# Altium project Main.PrjPcb
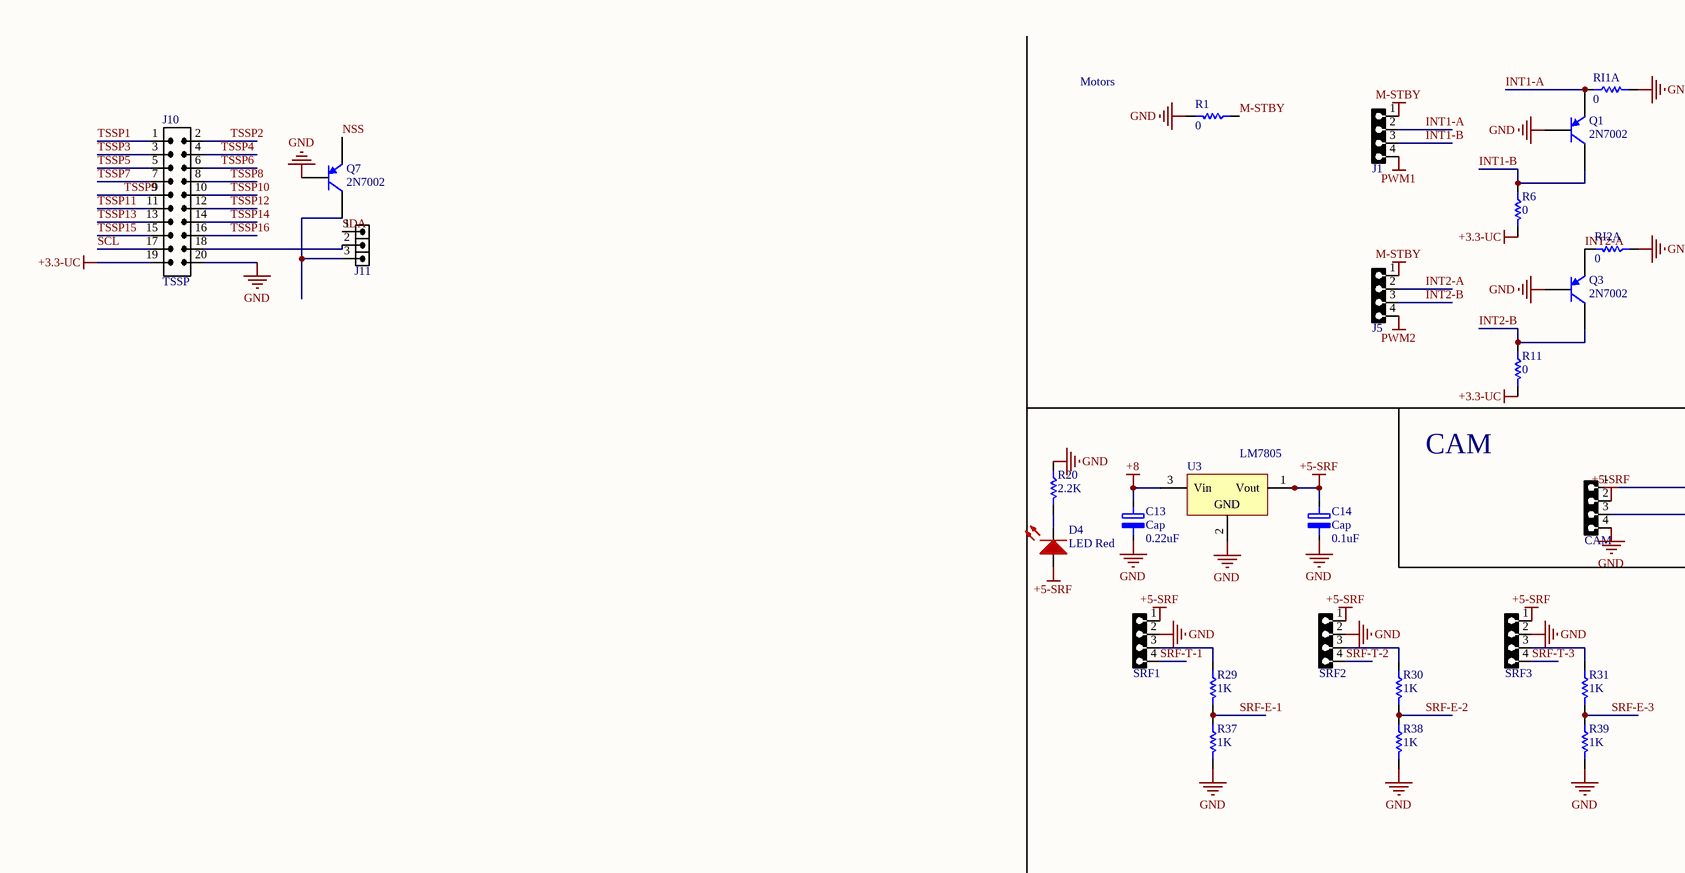
[diagram p0: main.SchDoc, top left]
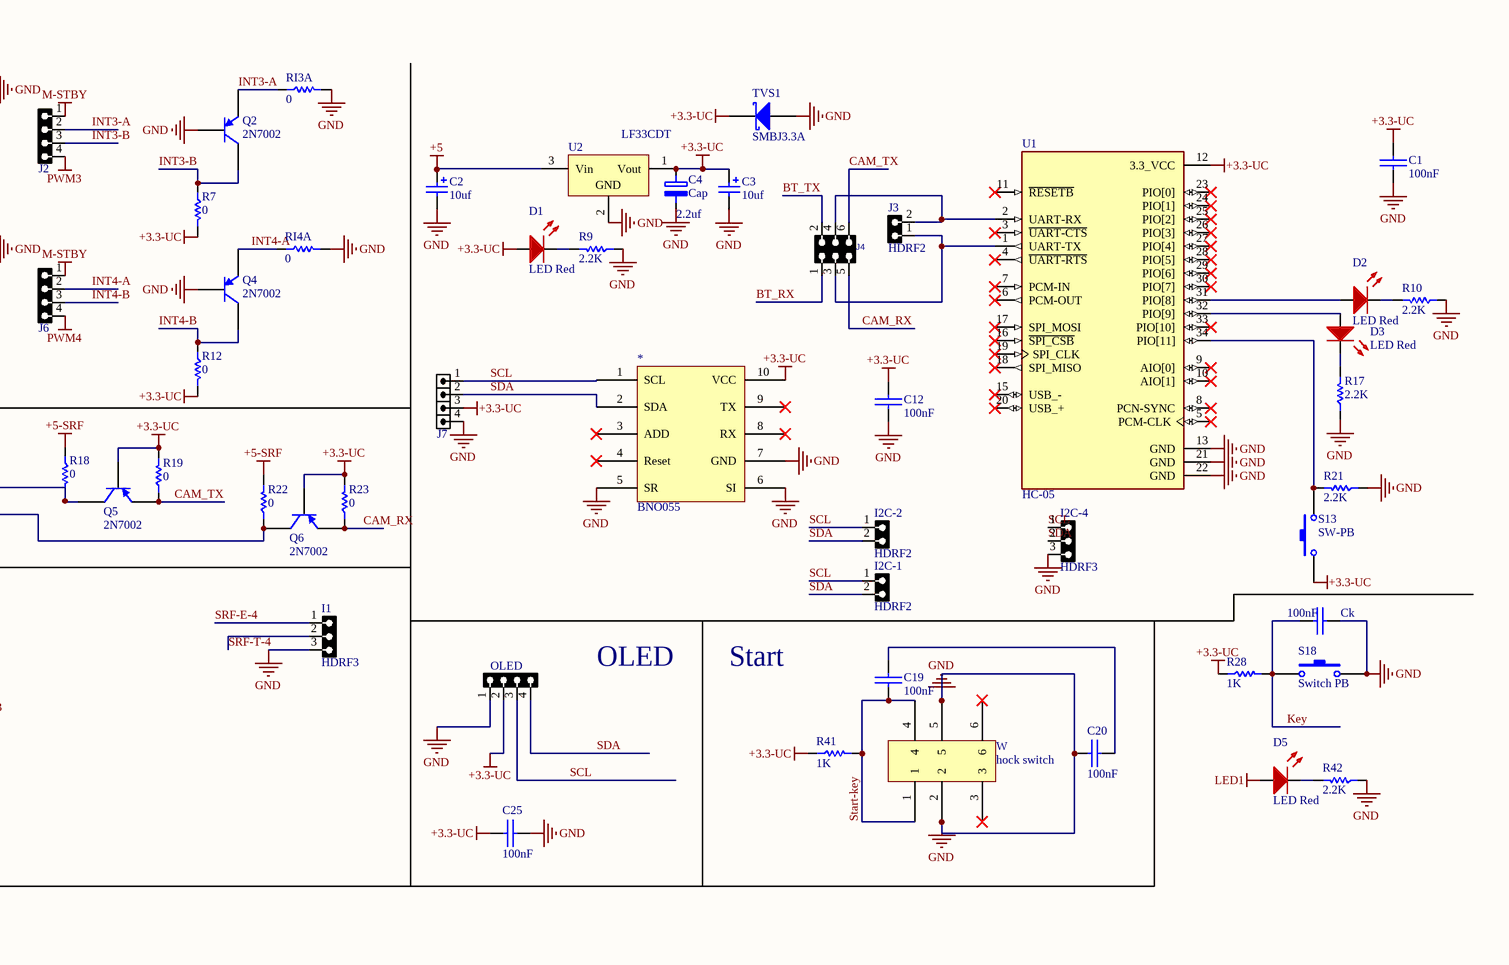
[diagram p1: main.SchDoc, top right]
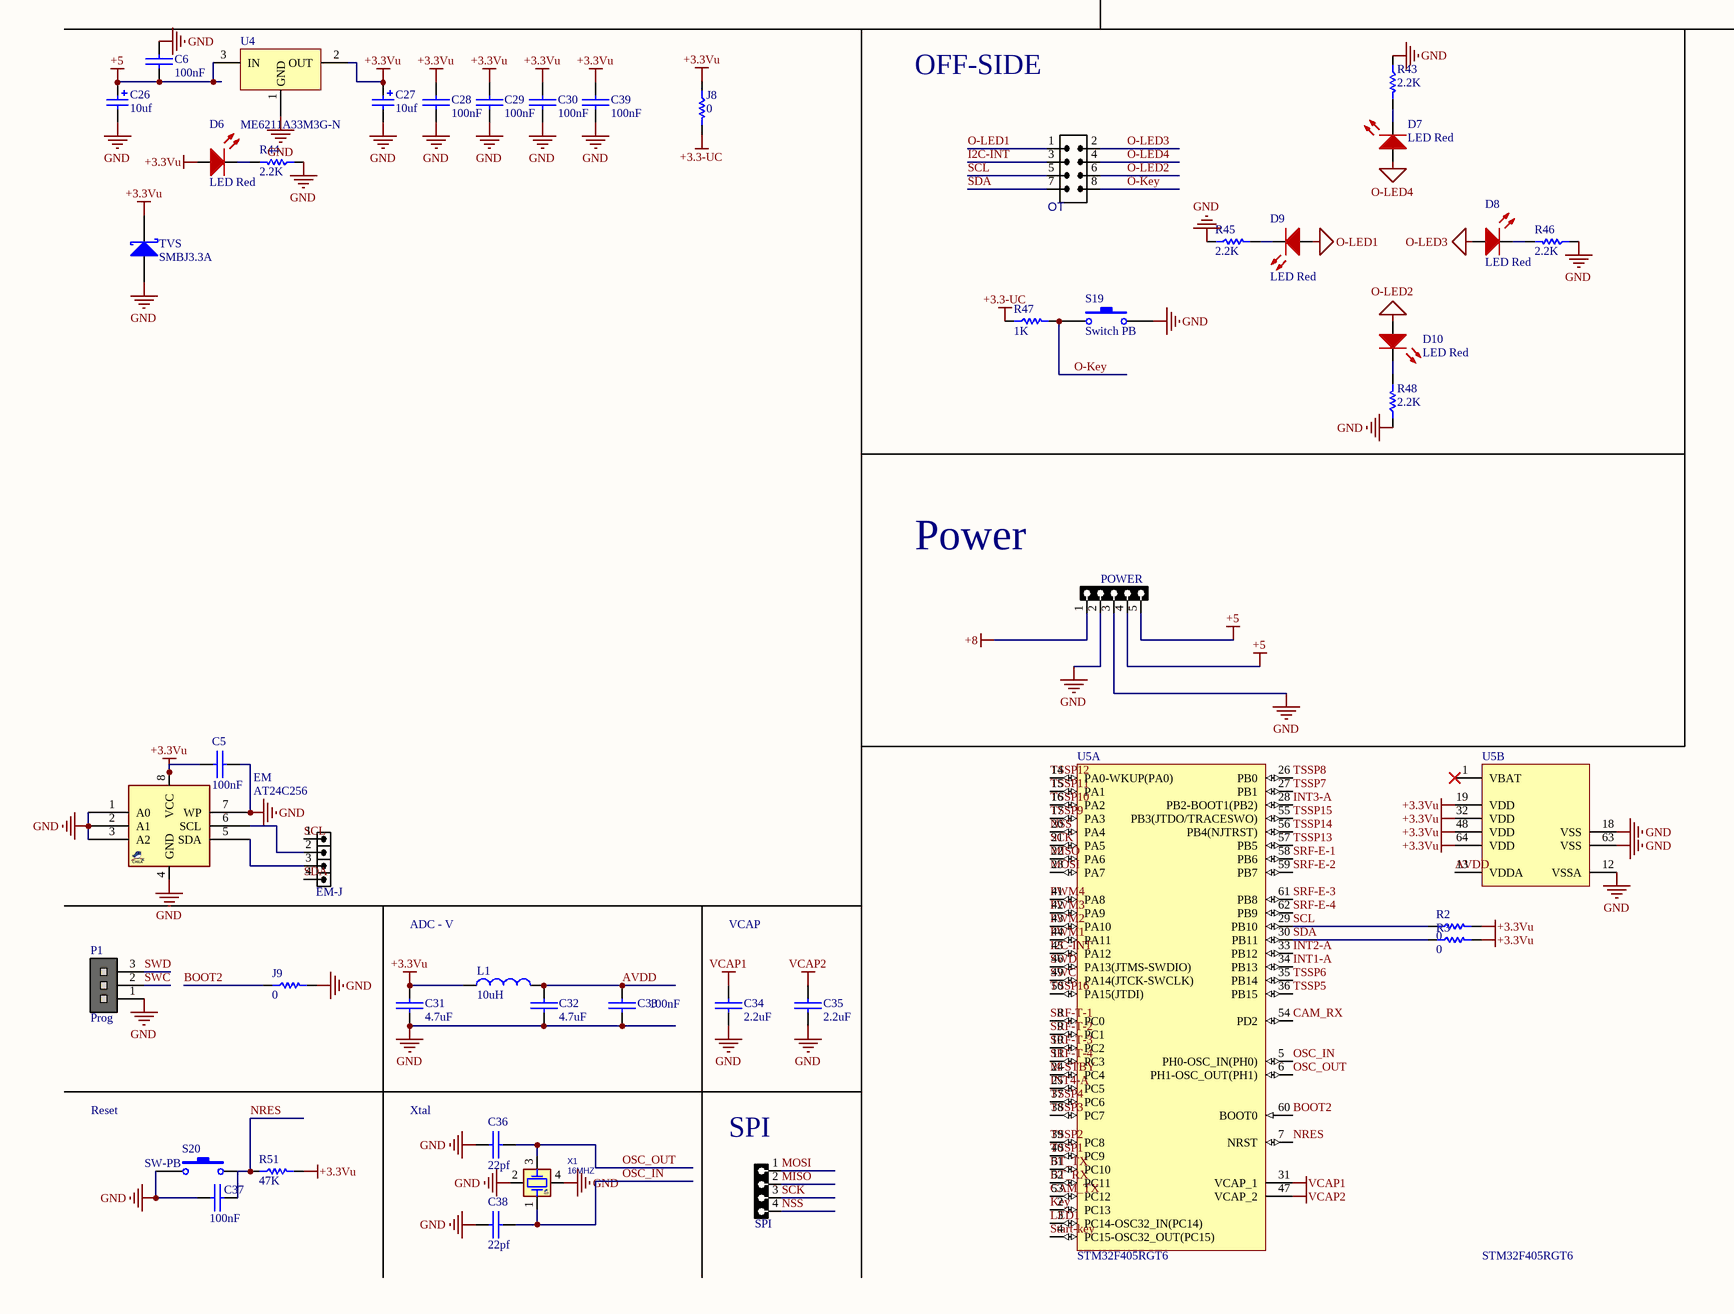
[diagram p2: main.SchDoc, bottom left]
1 sheet, 121 parts. Net scope: global (net labels, ports and power ports of the same name join across sheets).
Board files: main.PcbDoc, Mani-backup.PcbDoc, BNO-convertor.PcbDoc

## Sheet main.SchDoc
size 599 x 400 mm; SheetNumber: 1; SheetTotal: 1

### Parts
*  BNO055  [BNO055]
C1  100nF  [SMD_CAP_0805]
C2  value 10uf  [Cap_A]  (hidden comment: Cap_tan)
C3  value 10uf  [Cap_A]  (hidden comment: Cap_tan)
C4  Cap  value 2.2uf  [Cap_E]
C5  100nF  [C0603]
C6  100nF  [SMD_CAP_0805]
C12  100nF  [SMD_CAP_0805]
C13  Cap  C13: 0.22uF  [Cap1_(2mm)]
C14  Cap  C14: 0.1uF  [Cap1_(2mm)]
C19  100nF  [SMD_CAP_0805]
C20  100nF  [SMD_CAP_0805]
C25  100nF  [SMD_CAP_0805]
C26  value 10uf  [Cap_A]  (hidden comment: Cap_tan)
C27  value 10uf  [Cap_A]  (hidden comment: Cap_tan)
C28  100nF  [C0603]
C29  100nF  [C0603]
C30  100nF  [C0603]
C31  4.7uF  [SMD_CAP_0805]
C32  4.7uF  [SMD_CAP_0805]
C33  100nF  [SMD_CAP_0805]
C34  2.2uF  [C0603]
C35  2.2uF  [C0603]
C36  22pf  [SMD_CAP_0805]
C37  100nF  [SMD_CAP_0805]
C38  22pf  [SMD_CAP_0805]
C39  100nF  [C0603]
CAM  HDRF4  [HDR_F_1X4]  (value not drawn)
Ck  100nF  [SMD_CAP_0805]
D1  LED Red  [LED_Red_1206]
D2  LED Red  [LED_Red_1206]
D3  LED Red  [LED_Red_1206]
D4  LED Red  [LED_Red_1206]
D5  LED Red  [LED_Red_1206]
D6  LED Red  [LED_Red_1206]
D7  LED Red  [LED_Red_1206]
D8  LED Red  [LED_Red_1206]
D9  LED Red  [LED_Red_1206]
D10  LED Red  [LED_Red_1206]
EM  AT24C256  [SO_8]
EM-J  HDR4  [HDR1SE_M_1X4]  (value not drawn)
I1  HDRF3  [HDR_F_1X3]
I2C-1  HDRF2  [HDR_F_1X2]
I2C-2  HDRF2  [HDR_F_1X2]
I2C-4  HDRF3  [HDR_F_1X3]
J1  HDRF4  [HDR_F_1X4]  (value not drawn)
J2  HDRF4  [HDR_F_1X4]  (value not drawn)
J3  HDRF2  [HDR_F_1X2]
J4  HDRF_2X3  [HDR_F_2X3]  (value not drawn)
J5  HDRF4  [HDR_F_1X4]  (value not drawn)
J6  HDRF4  [HDR_F_1X4]  (value not drawn)
J7  HDR1X4  [HDR_M_1X4]  (value not drawn)
J8  0  [RES 0805 (2012X06L)]
J9  0  [RES 0603 (1608X06L)]
J10  TSSP  [IDC_2X10]
J11  HDR3  [HDR1SE_M_1X3]  (value not drawn)
L1  value 10uH  [Capacitor_805]  (hidden comment: Inductor)
OLED  HDRF4  [OLED64*128]  (value not drawn)
OT  IDC_2X4  [IDC_2X4]  (value not drawn)
P1  Prog  [HDR 1X3]
POWER  HDRF5  [HDR_F_1X5]  (value not drawn)
Q1  2N7002  [SOT23_BEC_M]
Q2  2N7002  [SOT23_BEC_M]
Q3  2N7002  [SOT23_BEC_M]
Q4  2N7002  [SOT23_BEC_M]
Q5  2N7002  [SOT23_BEC_M]
Q6  2N7002  [SOT23_BEC_M]
Q7  2N7002  [SOT23_BEC_M]
R1  0  [RES 0805 (2012X06L)]
R2  0  [RES 1206 (3216X08L)]
R3  0  [RES 1206 (3216X08L)]
R6  0  [RES 0805 (2012X06L)]
R7  0  [RES 0805 (2012X06L)]
R9  2.2K  [RES 0805 (2012X06L)]
R10  2.2K  [RES 0805 (2012X06L)]
R11  0  [RES 0805 (2012X06L)]
R12  0  [RES 0805 (2012X06L)]
R17  2.2K  [RES 0805 (2012X06L)]
R18  0  [RES 0805 (2012X06L)]
R19  0  [RES 0805 (2012X06L)]
R20  2.2K  [RES 0805 (2012X06L)]
R21  2.2K  [RES 0805 (2012X06L)]
R22  0  [RES 0805 (2012X06L)]
R23  0  [RES 0805 (2012X06L)]
R28  1K  [RES 0805 (2012X06L)]
R29  1K  [RES 0805 (2012X06L)]
R30  1K  [RES 0805 (2012X06L)]
R31  1K  [RES 0805 (2012X06L)]
R37  1K  [RES 0805 (2012X06L)]
R38  1K  [RES 0805 (2012X06L)]
R39  1K  [RES 0805 (2012X06L)]
R41  1K  [RES 0805 (2012X06L)]
R42  2.2K  [RES 0805 (2012X06L)]
R43  2.2K  [RES 0805 (2012X06L)]
R44  2.2K  [RES 0805 (2012X06L)]
R45  2.2K  [RES 0805 (2012X06L)]
R46  2.2K  [RES 0805 (2012X06L)]
R47  1K  [RES 0805 (2012X06L)]
R48  2.2K  [RES 0805 (2012X06L)]
R51  47K  [RES 0805 (2012X06L)]
RI1A  0  [RES 0805 (2012X06L)]
RI2A  0  [RES 0805 (2012X06L)]
RI3A  0  [RES 0805 (2012X06L)]
RI4A  0  [RES 0805 (2012X06L)]
S13  SW-PB  [SPST]
S18  Switch PB  [SW-PB]
S19  Switch PB  [SW-PB]
S20  SW-PB  [SPST]
SPI  HDRF4  [HDR_F_1X4]  (value not drawn)
SRF1  HDRF4  [HDR_F_1X4]  (value not drawn)
SRF2  HDRF4  [HDR_F_1X4]  (value not drawn)
SRF3  HDRF4  [HDR_F_1X4]  (value not drawn)
TVS  SMBJ3.3A  [Diode_SS34]
TVS1  SMBJ3.3A  [Diode_SS34]
U1  HC-05  [HC-05]
U2  LF33CDT  [TO 252]
U3  LM7805  [TO 252]
U4  ME6211A33M3G-N  [SOT23_3]
U5  STM32F405RGT6  [STM-LQFP64_N]  (parts A,B of 2)
W  hock switch  [hock switch]
X1  16MHZ  [XTL_4_3225]

### Nets
+3.3-UC: *.10(VCC) C1.1(+) C3.1 C4.1 C12.1(+) C25.1(+) D1.1(A) J7.3 J8.2 J10.19 OLED.2 Q5.1(B) Q6.1(B) R6.2 R7.2 R11.2 R12.2 R19.2 R23.2 R28.1 R41.1 R47.1 S13.1 TVS1.2(K) U1.12(3.3_VCC) U2.1(Vout)
+3.3Vu: C5.1(+) C27.1 C28.1(+) C29.1(+) C30.1(+) C31.1(+) C39.1(+) D6.1(A) EM.8(VCC) J8.1 L1.1 R2.2 R3.2 R51.2 TVS.2(K) U4.2(OUT) U5.19(VDD) U5.32(VDD) U5.48(VDD) U5.64(VDD)
+5: C2.1 C6.2(-) C26.1 POWER.4 POWER.5 U2.3(Vin) U4.3(IN)
+5-SRF: C14.1 CAM.2 D4.1(A) R18.1 R22.2 SRF1.1 SRF2.1 SRF3.1 U3.1(Vout)
+8: C13.1 POWER.1 U3.3(Vin)
GND: *.5(SR) *.6(SI) *.7(GND) C1.2(-) C2.2 C3.2 C4.2 C5.2(-) C6.1(+) C12.2(-) C13.2 C14.2 C20.1(+) C25.2(-) C26.2 C27.2 C28.2(-) C29.2(-) C30.2(-) C31.2(-) C32.2(-) C33.2(-) C34.2(-) C35.2(-) C36.2(-) C37.1(+) C38.2(-) C39.2(-) CAM.4 Ck.1(+) EM.1(A0) EM.2(A1) EM.3(A2) EM.4(GND) EM.7(WP) I1.3 I2C-4.3 J7.4 J9.2 J10.20 OLED.1 P1.1 POWER.2 POWER.3 Q1.1(B) Q2.1(B) Q3.1(B) Q4.1(B) Q7.1(B) R1.2 R9.1 R10.1 R17.1 R20.1 R21.1 R37.2 R38.2 R39.2 R42.1 R43.1 R44.1 R45.1 R46.1 R48.1 RI1A.2 RI2A.1 RI3A.2 RI4A.2 S18.2 S19.2 S20.1 SRF1.2 SRF2.2 SRF3.2 TVS.1(A) TVS1.1(A) U1.13(GND) U1.21(GND) U1.22(GND) U2.2(GND) U3.2(GND) U4.1(GND) U5.12(VSSA) U5.18(VSS) U5.63(VSS) W.2 W.5 X1.2 X1.4
LED1: D5.1(A) U5.3(PC14-OSC32_IN(PC14))
M-STBY: J1.1 J2.1 J5.1 J6.1 R1.1 U5.24(PC4)
O-LED1: D9.1(A) OT.1
O-LED2: D10.1(A) OT.6
O-LED3: D8.1(A) OT.2
O-LED4: D7.1(A) OT.4
PWM1: J1.4 U5.44(PA11)
PWM2: J5.4 U5.43(PA10)
PWM3: J2.4 U5.42(PA9)
PWM4: J6.4 U5.41(PA8)
VCAP1: C34.1(+) U5.31(VCAP_1)
VCAP2: C35.1(+) U5.47(VCAP_2)
AVDD: C32.1(+) C33.1(+) L1.2 U5.13(VDDA)
BOOT2: J9.1 U5.60(BOOT0)
BT_RX: J4.1 U5.52(PC11)
BT_TX: J4.2 U5.51(PC10)
CAM_RX: J4.5 Q6.2(E) R23.1 U5.54(PD2)
CAM_TX: J4.6 Q5.2(E) R19.1 U5.53(PC12)
I2C-INT: OT.3 U5.45(PA12)
INT1-A: J1.2 Q1.2(E) RI1A.1 U5.34(PB13)
INT1-B: J1.3 Q1.3(C) R6.1
INT2-A: J5.2 Q3.2(E) RI2A.2 U5.33(PB12)
INT2-B: J5.3 Q3.3(C) R11.1
INT3-A: J2.2 Q2.2(E) RI3A.1 U5.28(PB2-BOOT1(PB2))
INT3-B: J2.3 Q2.3(C) R7.1
INT4-A: J6.2 Q4.2(E) RI4A.1 U5.25(PC5)
INT4-B: J6.3 Q4.3(C) R12.1
Key: Ck.2(-) R28.2 S18.1 U5.2(PC13)
MISO: SPI.2 U5.22(PA6)
MOSI: SPI.1 U5.23(PA7)
NRES: C37.2(-) R51.1 S20.2 U5.7(NRST)
NSS: Q7.2(E) SPI.4 U5.20(PA4)
O-Key: OT.8 R47.2 S19.1
OSC_IN: C38.1(+) U5.5(PH0-OSC_IN(PH0)) X1.1
OSC_OUT: C36.1(+) U5.6(PH1-OSC_OUT(PH1)) X1.3
SCK: SPI.3 U5.21(PA5)
SCL: *.1(SCL) EM-J.1 I2C-1.1 I2C-2.1 I2C-4.1 J7.1 J10.17 OLED.3 OT.5 R2.1 U5.29(PB10)
SDA: *.2(SDA) EM-J.4 I2C-1.2 I2C-2.2 I2C-4.2 J7.2 J11.1 OLED.4 OT.7 R3.1 U5.30(PB11)
SRF-E-1: R29.2 R37.1 U5.58(PB6)
SRF-E-2: R30.2 R38.1 U5.59(PB7)
SRF-E-3: R31.2 R39.1 U5.61(PB8)
SRF-E-4: I1.1 U5.62(PB9)
SRF-T-1: SRF1.4 U5.8(PC0)
SRF-T-2: SRF2.4 U5.9(PC1)
SRF-T-3: SRF3.4 U5.10(PC2)
SRF-T-4: I1.2 U5.11(PC3)
Start-key: C19.1(+) R41.2 U5.4(PC15-OSC32_OUT(PC15)) W.1 W.4
SWC: P1.2 U5.49(PA14(JTCK-SWCLK))
SWD: P1.3 U5.46(PA13(JTMS-SWDIO))
TSSP1: J10.1 U5.40(PC9)
TSSP2: J10.2 U5.39(PC8)
TSSP3: J10.3 U5.38(PC7)
TSSP4: J10.4 U5.37(PC6)
TSSP5: J10.5 U5.36(PB15)
TSSP6: J10.6 U5.35(PB14)
TSSP7: J10.7 U5.27(PB1)
TSSP8: J10.8 U5.26(PB0)
TSSP9: J10.9 U5.17(PA3)
TSSP10: J10.10 U5.16(PA2)
TSSP11: J10.11 U5.15(PA1)
TSSP12: J10.12 U5.14(PA0-WKUP(PA0))
TSSP13: J10.13 U5.57(PB5)
TSSP14: J10.14 U5.56(PB4(NJTRST))
TSSP15: J10.15 U5.55(PB3(JTDO/TRACESWO))
TSSP16: J10.16 U5.50(PA15(JTDI))
NetC19_2: C19.2(-) C20.2(-)
NetCAM_1: CAM.1 Q5.3(C) R18.2
NetCAM_3: CAM.3 Q6.3(C) R22.1
NetD1_2: D1.2(K) R9.2
NetD2_1: D2.1(A) U1.31(PIO[8])
NetD2_2: D2.2(K) R10.2
NetD3_1: D3.1(A) U1.32(PIO[9])
NetD3_2: D3.2(K) R17.2
NetD4_2: D4.2(K) R20.2
NetD5_2: D5.2(K) R42.2
NetD6_2: D6.2(K) R44.2
NetD7_2: D7.2(K) R43.2
NetD8_2: D8.2(K) R46.2
NetD9_2: D9.2(K) R45.2
NetD10_2: D10.2(K) R48.2
NetEM_5: EM.5(SDA) EM-J.3
NetEM_6: EM.6(SCL) EM-J.2
NetJ3_1: J3.1 J4.3 U1.1(UART-TX)
NetJ3_2: J3.2 J4.4 U1.2(UART-RX)
NetJ10_18: J10.18 J11.2
NetJ11_3: J11.3 Q7.3(C)
NetR21_2: R21.2 S13.2 U1.34(PIO[11])
NetR29_1: R29.1 SRF1.3
NetR30_1: R30.1 SRF2.3
NetR31_1: R31.1 SRF3.3

Not connected (* = marked no-connect by the designer): * 3(ADD)* 4(Reset)* 8(RX)* 9(TX)*; U1 3(~{UART-CTS})* 4(~{UART-RTS})* 5(PCM-CLK)* 6(PCM-OUT)* 7(PCM-IN)* 8(PCN-SYNC)* 9(AIO[0])* 10(AIO[1])* 11(~{RESETB})* 15(USB_-)* 16(~{SPI_CSB})* 17(SPI_MOSI)* 18(SPI_MISO)* 19(SPI_CLK)* 20(USB_+)* 23(PIO[0])* 24(PIO[1])* 25(PIO[2])* 26(PIO[3])* 27(PIO[4])* 28(PIO[5])* 29(PIO[6])* 30(PIO[7])* 33(PIO[10])*; U5 1(VBAT)*; W 3* 6*

### Notes on the sheet
- Motors
- CAM
- OLED
- Start
- OFF-SIDE
- Power
- ADC - V
- VCAP
- Reset
- Xtal
- (near SPI) SPI

### Library data of the parts
C1 C5 C6 C12 C19 C20 C25 C28-C39 Ck = Cap-Bipolar: Bipolar Capacitor; Voltage: 100V; Designer: Saeid Jorablo; Organazation: ControTec; Adding Date: 1387/12/20
  C1 C5 C6 C12 C19 C20 C25 C28-C30 C33 C37 C39 Ck: Value: 100nF
  C31 C32: Value: 4.7uF
  C34 C35: Value: 2.2uF
  C36 C38: Value: 22pf
C2 C3 C26 C27 = Tantalum Cap: Solid Tantalum Chip Capacitor, Standard T491 Series - Industrial Grade; Published: 17-Jul-2002; LatestRevisionDate: 19-Mar-2004; LatestRevisionNote: Silkscreen dimensions re-sized.; DatasheetDocument: Mar-2001; PackageDocument: Mar-2001; PackageReference: B; Publisher: Altium Limited; Code_JEITA: 3528-21; ComponentLink1Description: Manufacturer Link; ComponentLink1URL: http://www.kemet.com/; ComponentLink2Description: Datasheet; ComponentLink2URL: http://www.kemet.com/kemet/web/homepage/kechome.nsf/vapubfilesname/F3102TA.pdf/$file/F3102TA.pdf
C4 C13 C14 = Cap_pol: Polarized Capacitor (Radial)
CAM J1 J2 J5 J6 OLED SPI SRF1-SRF3 = HDR_F_1X4: CONN, HEADER, Female, pitch: 2.54mm, 4POS; VALUE: HDRF4
EM = EEPROM_I2C_AT24C256_SOP8: EEPROM, I2C; Value: AT24C256
EM-J = HDRTST_1X4: HEADER, 1mm pitch, test, SMD; VALUE: HDR4
I1 I2C-4 = HDR_F_1X3: CONN, HEADER, Female, pitch: 2.54mm, 3POS; VALUE: HDRF3
I2C-1 I2C-2 J3 = HDR_F_1X2: CONN, HEADER, Female, pitch: 2.54mm, 2POS; VALUE: HDRF2
J4 = HDR_F_2X3: CONN, HEADER, Female, pitch: 2.54mm, 6POS; MANF_P#: MANF_PART#; MANF: MANF; VALUE: HDRF_2X3
J7 = HDR_M_1X4: CONN, HEADER, Male, pitch: 2.54mm, 4POS; VALUE: HDRM4
J8 J9 R1-R3 R6 R7 R9-R12 R17-R23 R28-R31 R37-R39 R41-R48 R51 RI1A RI2A RI3A RI4A = Resistor
  J8 J9 R1-R3 R6 R7 R11 R12 R18 R19 R22 R23 RI1A RI2A RI3A RI4A: Value: 0
  R9 R10 R17 R20 R21 R42-R46 R48: Value: 2.2K
  R28-R31 R37-R39 R41 R47: Value: 1K
  R51: Value: 47K
J10 = IDC_2X10: CONN, IDC, Male, pitch: 2.54mm, 20POS; VALUE: IDC_2X10
J11 = HDRTST_1X3: HEADER, 1mm pitch, test, SMD; VALUE: HDR3
OT = IDC_2X4: CONN, IDC, Male, pitch: 2.54mm, 8POS; VALUE: IDC_2X4
P1 = Header 3: Header, 3-Pin
POWER = HDR_F_1X5: CONN, HEADER, Female, pitch: 2.54mm, 5POS; VALUE: HDRF5
Q1-Q7 = PNP: PNP Bipolar Transistor; Published: 8-Jun-2000; LatestRevisionDate: 29-May-2009; LatestRevisionNote: IPC-7351 Footprint Added.; PackageVersion: Aug-1999; PackageReference: SOT-23B; Publisher: Altium Limited; PackageDescription: 3-Pin SOT-23 Package 0.95 mm Pitch, 2.4 mm Lead Span
S13 S20 = SW-PB: Switch
S18 S19 = Switch PB: Push Button Switch
TVS TVS1 = 1N5819: Schottky diode
U1 = HC-05: Bluetooth to Serial Port Module; MP: HC-05; Value: *; Price: None; Package: None; Availability: Unavailable
U2 = LM7805
U4 = ME6211A33M3G-N: IC, Regulator, Linear LDO ,Low noise
U5 = STM32F405RGT6: ARM Cortex-M4 32-bit MCU+FPU, 210 DMIPS, 1024 kB Flash, 192 kB Internal RAM, 51 I/Os, 64-pin LQFP, -40 to 85 degC, Tray; Manufacturer: STMicroelectronics; Supply Voltage(Vcc) min (V): 1.8; Supply Voltage(Vcc) max (V): 3.6; Internal RAM Size (kB): 192; I/Os (High Current): 51; D/A Converter: 2x12-bit; FLASH Size (Prog) (kB): 1024; Operating Frequency(F) (Processor speed) (MHz): 168; ComponentLink2Description: Datasheet; PackageVersion: Rev. 4, 06/2013; DatasheetVersion: Rev. 4; Core: ARM Cortex-M4; ComponentLink2URL: http://www.st.com/st-web-ui/static/active/en/resource/technical/document/datasheet/DM00037051.pdf; PackageReference: LQFP64; Packing: Tray; ComponentLink1Description: Manufacturer URL; ComponentLink3URL: http://www.st.com/st-web-ui/static/active/en/resource/technical/document/datasheet/DM00037051.pdf; ComponentLink3Description: Package Specification; Mounting Technology: Surface Mount; ComponentLink1URL: http://www.st.com/web/en/home.html; PackageDescription: 64-Pin Low Profile Quad Flat Package, 10 x 10 mm Body, 0.5 mm Pitch; PartNumber: STM32F405RGT6
X1 = XTL_16MHz_3225: Crystal 24MHz; MANF: EPSON; MANF_P#: TSX-3225 24.0000MF10Z-C3; PARAM2: 10PPM, 18pF; PARAM: -20~75oC; PRICE: 0.5$
L1 = Inductor: Published: 8-Jun-2000; Revision: July-2002: Re-released for DXP Platform.; Publisher: Altium Limited